# EAGLE design RH026.2 (EAGLE 7.1.0)
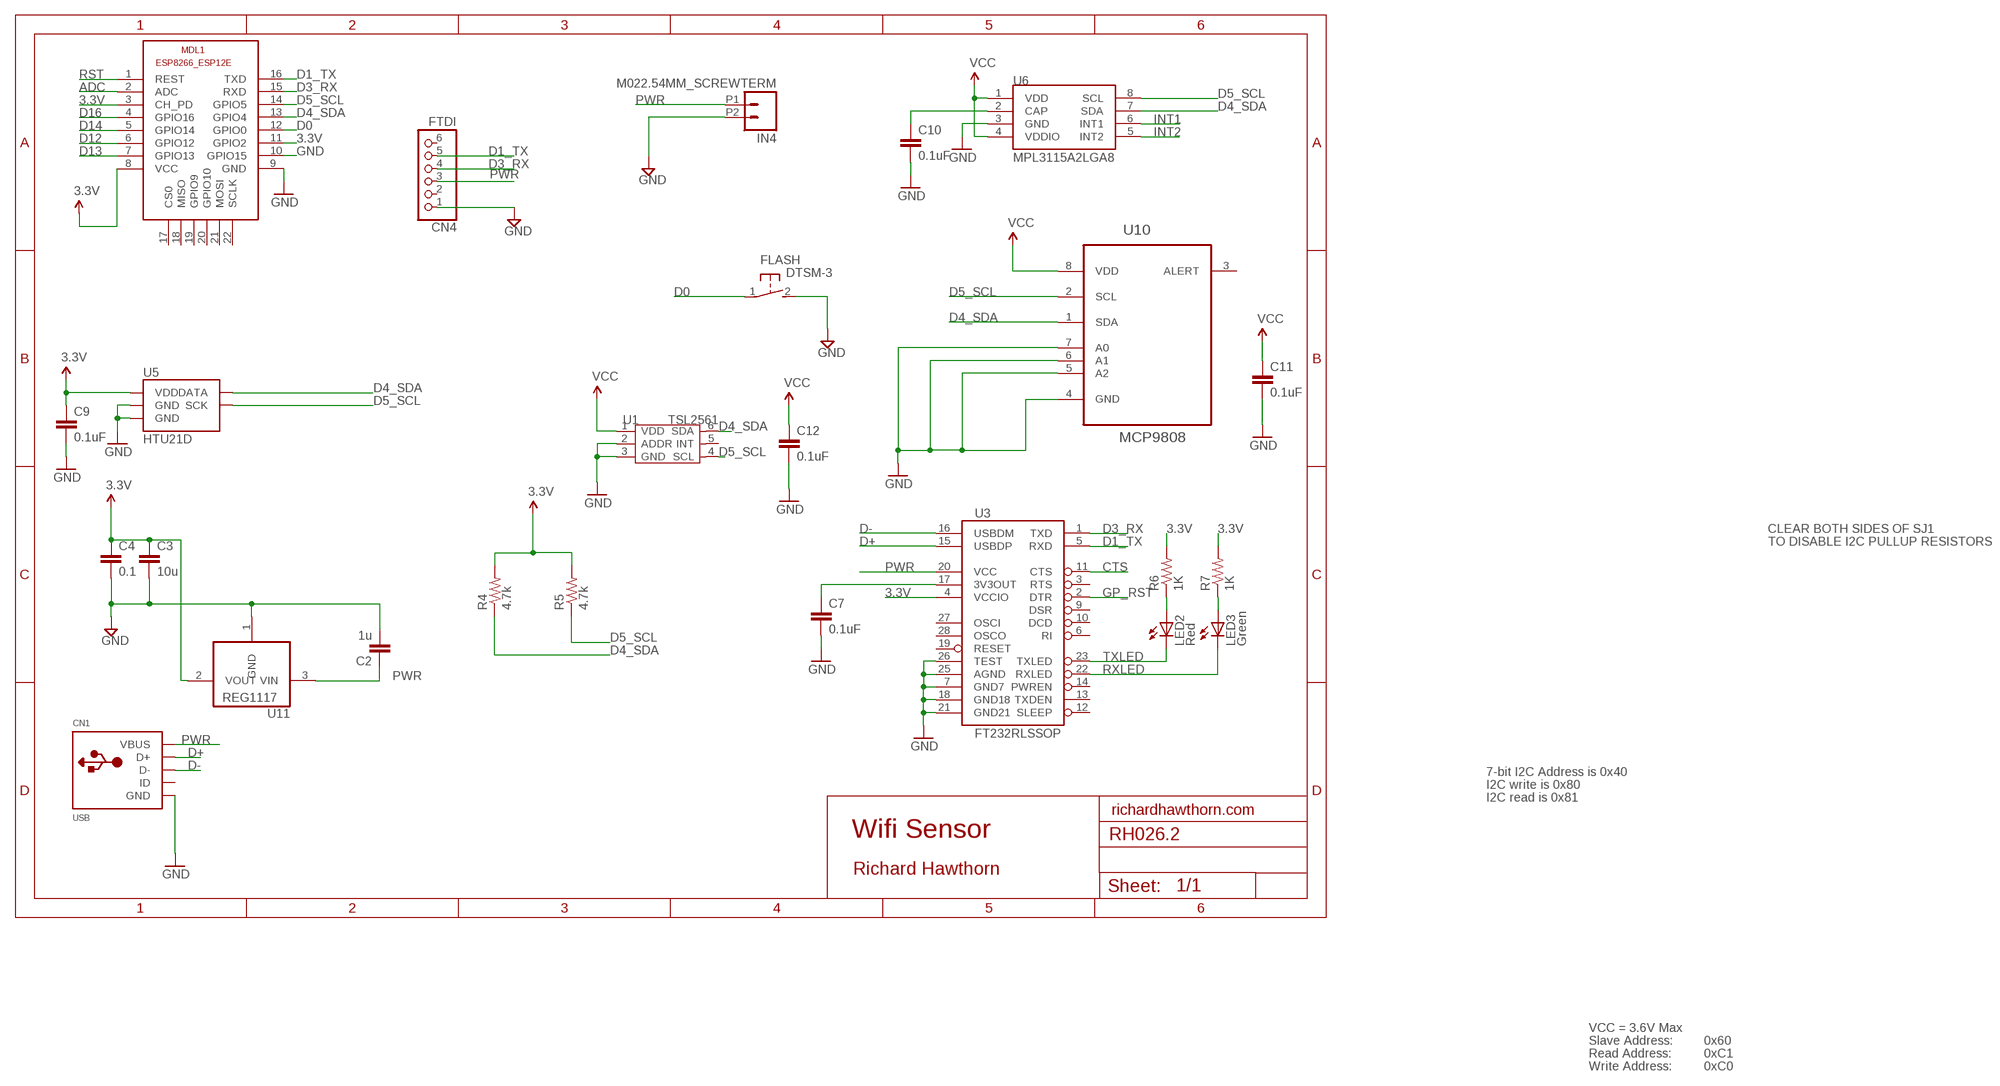
[diagram p0: schematic, sheet 1]

## Parts
C2  1u  CAP0603-CAP  [0603-CAP]
C3  10u  CAP0805-CAP  [0805-CAP]
C4  0.1  CAP0603-CAP  [0603-CAP]
C7  0.1uF  CAP0402-CAP  [0402-CAP]
C9  0.1uF  CAP0805  [0805]
C10  0.1uF  CAP0805  [0805]
C11  0.1uF  CAP0603-CAP  [0603-CAP]
C12  0.1uF  CAP0603-CAP  [0603-CAP]
CN1  USB  USBMINIB  [USB-MINIB]
CN4  FTDI  PINHD-1X6  [1X06]
FLASH  DTSM-3  [DTSM-3]
IN4  M022.54MM_SCREWTERM  [1X02_2.54_SCREWTERM]
LED2  Red  LED0603  [LED-0603]
LED3  Green  LED0603  [LED-0603]
MDL1  ESP8266-12EESP8266-ESP12E  [ESP8266-ESP12E]
R4  4.7k  RESISTOR0805-RES  [0805]
R5  4.7k  RESISTOR0805-RES  [0805]
R6  1K  RESISTOR0402-RES  [0402-RES]
R7  1K  RESISTOR0402-RES  [0402-RES]
U1  TSL2561  TSL2561T  [TMB-6]
U3  FT232RLSSOP  [SSOP28DB]
U5  HTU21D  HTU21DSMD  [HTU21D]
U6  MPL3115A2LGA8  [LGA8]
U10  MCP9808  MCP9808-E/MS  [SOP65P490X110-8N]
U11  REG1117  [SOT223]

## Nets
3.3V: C3.1 C4.1 C9.1 C11.1 C12.1 MDL1.3(CH_PD) MDL1.8(VCC) MDL1.11(GPIO2) R4.2 R5.2 R6.2 R7.2 U1.1(VDD) U3.4(VCCIO) U5.VDD U6.1(VDD) U6.4(VDDIO) U10.8(VDD) U11.2(VOUT) ; supply symbol labelled VCC
3.3VOUT: C7.1 U3.17(3V3OUT)
ADC: MDL1.2(ADC)
CTS: U3.11(CTS)
D0: FLASH.1 MDL1.12(GPIO0)
D1_TX: CN4.5 MDL1.16(TXD) U3.5(RXD)
D3_RX: CN4.4 MDL1.15(RXD) U3.1(TXD)
D4_SDA: MDL1.13(GPIO4) R4.1 U1.6(SDA) U5.DATA U6.7(SDA) U10.1(SDA)
D5_SCL: MDL1.14(GPIO5) R5.1 U1.4(SCL) U5.SCK U6.8(SCL) U10.2(SCL)
D12: MDL1.6(GPIO12)
D13: MDL1.7(GPIO13)
D14: MDL1.5(GPIO14)
D16: MDL1.4(GPIO16)
D+: CN1.D+ U3.15(USBDP)
D-: CN1.D- U3.16(USBDM)
GND [power]: C2.2 C3.2 C4.2 C7.2 C9.2 C10.2 C11.2 C12.2 CN1.GND CN4.1 FLASH.2 IN4.P2 MDL1.9(GND) MDL1.10(GPIO15) U1.2(ADDR) U1.3(GND) U3.7(GND7) U3.18(GND18) U3.21(GND21) U3.25(AGND) U3.26(TEST) U5.7(GND) U5.GND U6.3(GND) U10.4(GND) U10.5(A2) U10.6(A1) U10.7(A0) U11.1(GND)
GP_RST: U3.2(DTR)
INT1: U6.6(INT1)
INT2: U6.5(INT2)
N$2: LED2.A R6.1
N$3: LED3.A R7.1
N$9: C10.1 U6.2(CAP)
PWR [power]: C2.1 CN1.VBUS CN4.3 IN4.P1 U3.20(VCC) U11.3(VIN)
RST: MDL1.1(REST)
RXLED: LED3.C U3.22(RXLED)
TXLED: LED2.C U3.23(TXLED)
Unconnected: CN1.ID CN4.2 CN4.6 MDL1.17(CS0) MDL1.18(MISO) MDL1.19(GPIO9) MDL1.20(GPIO10) MDL1.21(MOSI) MDL1.22(SCLK) U1.5(INT) U3.3(RTS) U3.6(RI) U3.9(DSR) U3.10(DCD) U3.12(SLEEP) U3.13(TXDEN) U3.14(PWREN) U3.19(RESET) U3.27(OSCI) U3.28(OSCO) U10.3(ALERT)

## Notes on the sheet
- CLEAR BOTH SIDES OF SJ1
- TO DISABLE I2C PULLUP RESISTORS
- 7-bit I2C Address is 0x40
- I2C write is 0x80
- I2C read is 0x81
- richardhawthorn.com
- Wifi Sensor
- Richard Hawthorn
- VCC = 3.6V Max
- Slave Address: | 0x60
- Read Address: | 0xC1
- Write Address: | 0xC0

## Library data of the parts
C2-C4 = LowPowerLab:CAP: Capacitor Standard 0603 ceramic capacitor, and 0.1" leaded capacitor.
C7 C9-C12 = SparkFun:CAP: Capacitor Standard 0603 ceramic capacitor, and 0.1" leaded capacitor.
CN1 = LowPowerLab:USB: USB Connectors USBMINIB - Surface Mount Female Mini-B USB Connector 4UConnector: 06564 By microbuilder.eu Thru-hole RA Female Mini-B USB Connector 4UConnector: 18732 By ladyada.net
CN4 = pinhead:PINHD-1X6: PIN HEADER
FLASH = switch-tact:DTSM-3
IN4 = SparkFun-Connectors:M02: Standard 2-pin 0.1" header. Use with - straight break away headers ( PRT-00116) - right angle break away headers (PRT-00553) - swiss pins (PRT-00743) - machine pins (PRT-00117) - female headers (PRT-00115) Molex polarized connector foot print use with: PRT-08233 with associated crimp pins and housings. 2.54_SCREWTERM for use with PRT-10571. 3.5mm Screw Terminal footprints for PRT-08084 5mm Screw Terminal footprints for use with PRT-08432
LED2 LED3 = SparkFun:LED: LEDs Standard schematic elements and footprints for 5mm, 3mm, 1206, and 0603 sized LEDs. 5mm - Spark Fun Electronics SKU : COM-00529 (and others)
MDL1 = ESP8266-ESP12E:ESP8266-12E: ESP8266-12E with additional I/O and GPIO04/05 corrected The author cannot warrant that this library is free from error or will meet your specific requirements. Created by PuceBaboon.com. Komagane, Nagano, JAPAN
R4-R7 = SparkFun:RESISTOR: Resistor Basic schematic elements and footprints for 0603, 1206, and PTH resistors.
U1 = template:TSL2561: Light-TO-Digital Converter
U3 = SparkFun:FT232RL: USB UART FT232RL 4th Generation USB UART (USB <-> Serial) Controller. Spark Fun Electronics SKU : COM-00650
U5 = SparkFun-Sensors:HTU21D
U6 = SparkFun-Sensors:MPL3115A2: Altimeter/Pressure Sensor, I2C, 1.95V-3.6V supply, 50 to 110kPa
U10 = Richard1:MCP9808-E/MS: Digital Temperature Sensor,MSOP-8; MPN: MCP9808-E/MS; OC_FARNELL: 2080523; OC_NEWARK: 89T8871; PACKAGE: MSOP-8; SUPPLIER: MICROCHIP
U11 = burr-brown:REG1117: 800mA and 1A Low Dropout (LDO) Positive Regulator 1.8V, 2.5V, 2.85V, 3.3V, 5V, and Adj; MPN: REG1117; OC_FARNELL: 1097566; OC_NEWARK: 14P6981

## Net classes
1 power: width 0.381 mm, clearance 0.254 mm

## Board
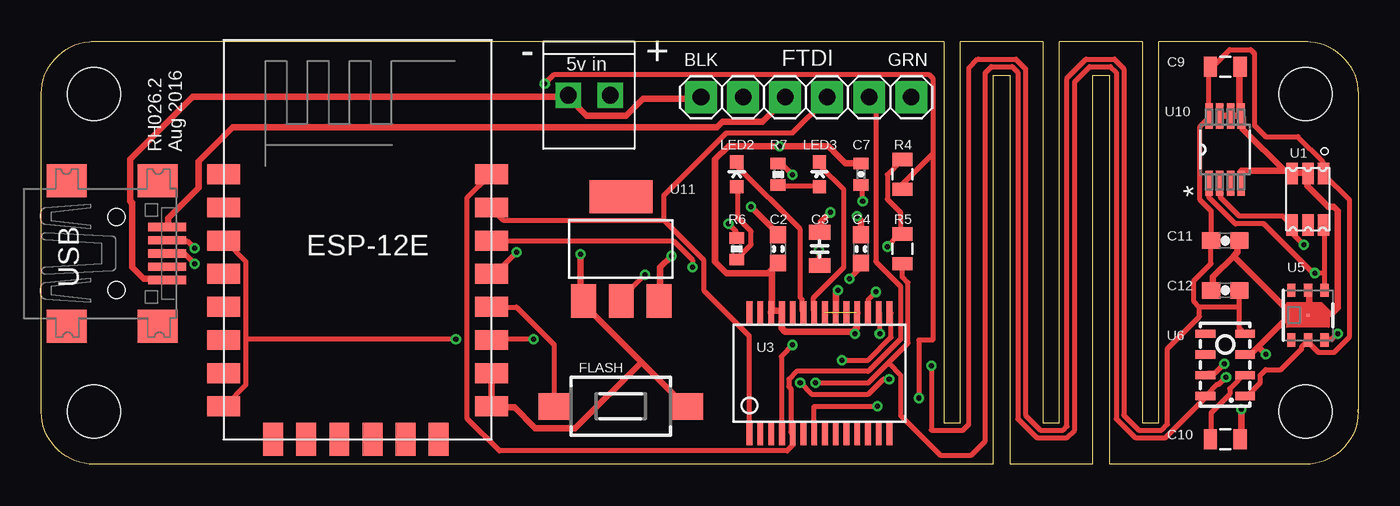
[diagram p1: board, top side]
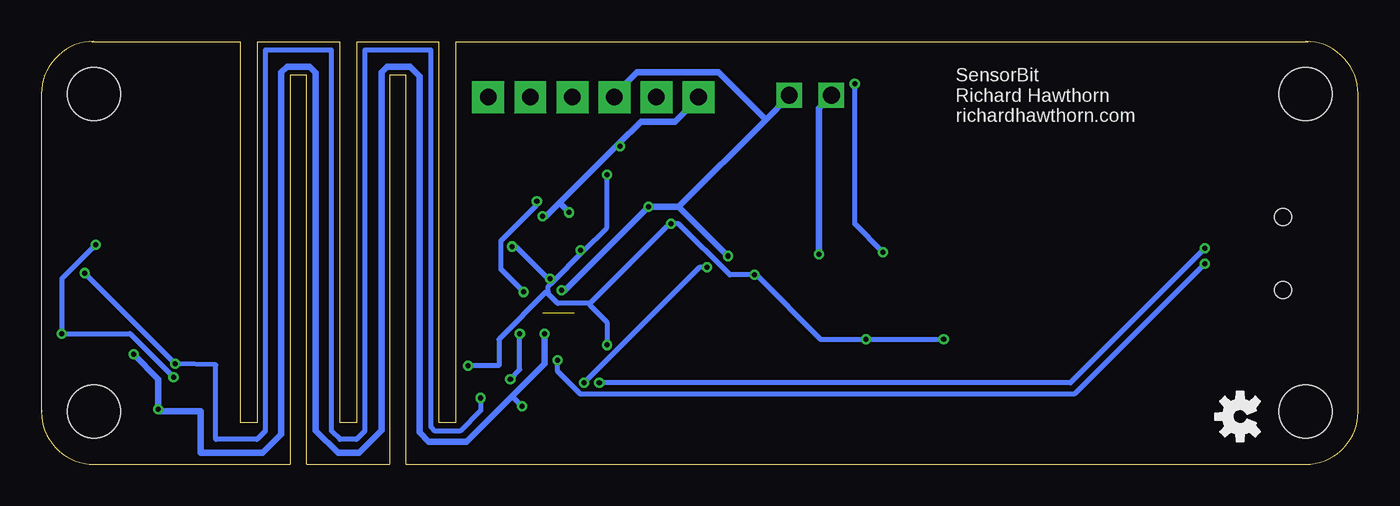
[diagram p2: board, bottom side, seen from below]

Size 79.53 x 25.53 mm. Coordinates in mm from the lower left corner, seen from the top.
Outline: 3.17,25.53 arc90 0,22.36 0,3.17 arc90 3.17,0 57.5,0 57.5,23.5 58.5,23.5 58.5,0 63.5,0 63.5,23.5 64.5,23.5 64.5,0 76.36,0 arc90 79.53,3.17 79.5,3.17 79.5,3.25 79.53,3.25 79.53,22.36 arc90 76.36,25.53
Outline: 76.5,25.5 67.5,25.5 67.5,2.5 66.5,2.5 66.5,25.5 61.5,25.5 61.5,2.5 60.5,2.5 60.5,25.5 55.5,25.5 55.5,2.5 54.5,2.5 54.5,25.5 3,25.5
Copper layers (1*16): Top 0.035mm / dielectric 1.5mm / Bottom 0.035mm
Design rules "ITEADstudio_DRC *": minimum track width 12mil, minimum drill 12mil, track to track 6mil, track to pad 6mil, pad to pad 6mil, via to via 6mil, smd to smd 0mil, copper to edge 10mil, drill to drill 10mil, minimum pad ring 10mil, minimum via ring 6mil, stop-mask expansion 2mil, vias tented up to drill 100mil, thermal gap 15mil
Holes 3.2 mm at 3.17,3.17 76.36,3.17 3.17,22.36 76.36,22.36
tRestrict: area 74,0 to 79.5,5.5; area 0,20 to 5.5,25.5; area 0,0 to 5.5,5.5; area 74,20 to 79.5,25.5
bRestrict: area 0,0 to 5.5,5.5; area 0,20 to 5.5,25.5; area 74,20 to 79.5,25.5

### Footprints (pad centres in the part's own frame; a part is rotated, then mirrored left to right if it is on the bottom)
0603-CAP = smd 1.016 x 0.965: 1 -0.85,0; 2 0.85,0
0805-CAP = smd 0.902 x 1.3: 1 -1,0; 2 1,0
0402-CAP = smd 0.7 x 0.9: 1 -0.65,0; 2 0.65,0
0805 = smd 0.8 x 1.2: 1 -0.9,0; 2 0.9,0
0603-CAP' = smd 1.1 x 1: 1 -0.85,0; 2 0.85,0
USB-MINIB = smd 0.5 x 2.308: D+ 0,4.064; D- -0.8,4.064; GND 1.6,4.064; ID 0.8,4.064; VBUS -1.6,4.064 | smd 2 x 2.4: GND1 -4.4,-2; GND2 -4.4,3.5; GND3 4.4,3.5; GND4 4.4,-2 | hole 1: -2.2,1; 2.2,1
1X06 = drill 1 pad 1.93 square: 1 -6.35,0; 2 -3.81,0; 3 -1.27,0; 4 1.27,0; 5 3.81,0; 6 6.35,0
DTSM-3 = smd 2 x 1.6: 1 -3.97,0; 2 3.97,0
1X02_2.54_SCREWTERM = drill 1.016 square: P1 2.54,0; P2 0,0
LED-0603 = smd 0.8 x 0.8: A 0,-0.75; C 0,0.75
ESP8266-ESP12E = smd 2 x 1.2: 1 0,16; 2 0,14; 3 0,12; 4 0,10; 5 0,8; 6 0,6; 7 0,4; 8 0,2; 9 16.2,2; 10 16.2,4; 11 16.2,6; 12 16.2,8; 13 16.2,10; 14 16.2,12; 15 16.2,14; 16 16.2,16 | smd 1.2 x 2: 17 11,0; 18 3,0; 19 5,0; 20 13,0; 21 7,0; 22 9,0
0402-RES = smd 0.7 x 0.9: 1 -0.65,0; 2 0.65,0
TMB-6 = smd 1.3 x 0.7: 1 -1.55,0.95; 2 -1.55,0; 3 -1.55,-0.95; 4 1.55,-0.95; 5 1.55,0; 6 1.55,0.95
SSOP28DB = smd 0.348 x 1.397: 1 -4.225,-3.656; 2 -3.575,-3.656; 3 -2.925,-3.656; 4 -2.275,-3.656; 5 -1.625,-3.656; 6 -0.975,-3.656; 7 -0.325,-3.656; 8 0.325,-3.656; 9 0.975,-3.656; 10 1.625,-3.656; 11 2.275,-3.656; 12 2.925,-3.656; 13 3.575,-3.656; 14 4.225,-3.656; 15 4.225,3.656; 16 3.575,3.656; 17 2.925,3.656; 18 2.275,3.656; 19 1.625,3.656; 20 0.975,3.656; 21 0.325,3.656; 22 -0.325,3.656; 23 -0.975,3.656; 24 -1.625,3.656; 25 -2.275,3.656; 26 -2.925,3.656; 27 -3.575,3.656; 28 -4.225,3.656
HTU21D = smd 0.2 x 0.2: 7 0,0 | smd 0.8 x 0.5: DATA 1.5,-1; GND 1.5,0; NC@1 -1.5,1; NC@6 1.5,1; SCK -1.5,-1; VDD -1.5,0
LGA8 = smd 1.2 x 0.5: 1 -1.2,1.875; 2 -1.2,0.625; 3 -1.2,-0.625; 4 -1.2,-1.875; 5 1.2,-1.875; 6 1.2,-0.625; 7 1.2,0.625; 8 1.2,1.875
SOP65P490X110-8N = smd 1.524 x 0.457: 1 -2.032,0.965; 2 -2.032,0.33; 3 -2.032,-0.33; 4 -2.032,-0.965; 5 2.032,-0.965; 6 2.032,-0.33; 7 2.032,0.33; 8 2.032,0.965
SOT223 = smd 1.499 x 2.007: 1 -2.261,-3.15; 2 0.025,-3.15; 3 2.311,-3.15 | smd 3.81 x 2.007: 4 0,3.15

### Placement (x,y rotation side)
C2  44.5,13 270 top
C3  47,13 90 top
C4  49.5,13 90 top
C7  49.5,17.5 90 top
C9  71.5,24 0 top
C10  71.5,1.5 0 top
C11  0.1uF  [0603-CAP']  71.5,13.5 0 top
C12  0.1uF  [0603-CAP']  71.5,10.5 180 top
CN1  3.53,12.73 270 top
CN4  46.19,22.17 0 top
FLASH  35,3.5 0 top
IN4  31.82,22.29 0 top
LED2  42,17.5 0 top
LED3  47,17.5 0 top
MDL1  11,1.5 0 top
R4  52,17.5 90 top
R5  52,13 90 top
R6  42,13 90 top
R7  44.5,17.5 90 top
U1  76.5,16 270 top
U3  47,5.5 0 top
U5  76.5,9 90 top
U6  71.5,6 180 top
U10  71.5,19 90 top
U11  35,13 0 top
U$3  [OSHW-LOGO-S]  7.13,2.88 90 bottom

### Tracks (layer width: path | path; a pad name or v marks a point on that pad's centre or on a via)
3.3V  (via drill 0.3)
  Top 0.305: 72.35,9.49 72.35,8.23 U6.4 | 72.35,9.49 72.35,10.4 C12.1 | 69.95,9.49 69.61,9.83 69.61,11.09 70.64,12.12 70.64,13.49 C11.1 70.64,13.6 70.64,15.32 69.95,16 69.95,20.34 70.52,20.92 U10.8 70.52,21.14 70.52,23.89 C9.1 70.75,24 71.78,25.03 73.04,25.03 73.27,24.8 73.27,20.46 73.95,19.77 75.89,19.77 77.38,18.29 77.38,17.6 U1.1 77.5,17.49 78.98,16 78.98,7.66 78.07,6.74 77.15,6.74 76.58,7.32 U5.VDD 76.47,7.43 76.12,7.09 76.12,6.97 74.87,5.71 73.95,5.71 73.61,5.37 73.61,4.92 72.81,4.12 U6.1 | 72.35,9.49 69.95,9.49 | 12.34,7.54 12.34,12.23 11.09,13.49 MDL1.3 | 12.34,7.54 12.34,4.8 11.09,3.54 MDL1.8 | R4.2 51.89,18.29 51.09,17.49 51.09,16 51.89,15.2 51.89,13.95 R5.2 51.78,13.83 v51.09,13.14 | v41.49,14.52 41.95,14.06 41.95,13.72 R6.2 | v36.46,11.43 34.98,9.94 U11.2 | v45.38,17.49 44.81,18.06 44.58,18.06 R7.2 | v48.81,11.2 49.49,11.89 49.49,12.12 C4.1 | v46.98,12.92 46.98,12 C3.1 | v45.38,7.2 44.69,6.51 44.69,1.94 U3.4 | v29.72,7.54 27.2,7.54 MDL1.11 | v25.03,7.54 12.34,7.54 | 69.95,9.49 69.95,8.91 68.01,6.97 68.01,2.4 67.67,2.06 66.29,2.06 65.38,2.97 65.38,23.89 64.81,24.46 63.09,24.46 61.95,23.32 61.95,2.29 61.72,2.06 60.35,2.06 59.44,2.97 59.44,23.89 58.86,24.46 56.58,24.46 56.58,24.48 56.01,23.91 56.01,2.4 55.66,2.06 53.75,2.06 v53.75,5.96
  Bottom 0.305: v45.38,17.49 45.38,14.29 46.81,12.86 | 48.63,11.03 48.92,10.74 48.92,10.4 | 48.63,11.03 46.81,12.86 | 48.92,10.4 48.92,10.29 48.35,9.72 46.41,9.72 | 46.41,9.72 41.6,14.52 v41.49,14.52 41.03,14.52 37.95,11.43 v36.46,11.43 36.35,11.43 32.46,7.54 v29.72,7.54 v25.03,7.54 | 48.63,11.03 v48.81,11.2 48.92,11.2 50.86,13.14 v51.09,13.14 | v46.98,12.92 46.86,12.92 46.81,12.86 | v45.38,7.2 45.38,8.57 46.41,9.6 46.41,9.72 | v53.75,5.96 51.89,5.96 51.89,7.54 49.03,10.4 48.92,10.4
3.3VOUT  (via drill 0.3)
  Top 0.305: v49.61,15.89 49.61,16.8 C7.1 | v50.41,10.4 49.95,9.94 49.95,9.26 U3.17
  Bottom 0.305: v49.61,15.89 49.61,15.66 51.78,13.49 51.78,11.77 v50.41,10.4
D0
  Top 0.305: FLASH.1 30.98,3.54 30.98,7.2 28.69,9.49 27.2,9.49 MDL1.12
D1_TX
  Top 0.305: CN4.5 50.06,22.06 50.41,21.72 50.41,12.23 51.89,10.74 51.89,7.54 49.95,5.6 45.61,5.6 45.15,5.14 45.15,4.69 45.26,4.57 45.26,1.94 U3.5 45.38,1.71 45.38,1.14 45.03,0.8 27.66,0.8 25.72,2.74 25.72,16.12 27.09,17.49 MDL1.16
D3_RX
  Top 0.305: 37.6,14.74 40.01,12.34 40.01,10.52 42.75,7.77 42.75,1.94 U3.1 | 37.6,14.74 27.89,14.74 27.2,15.43 MDL1.15 | 37.6,14.74 37.6,16.23 41.38,20 45.38,20 47.43,22.06 CN4.4
D4_SDA  (via drill 0.3)
  Top 0.305: 53.84,18.75 52.01,16.92 52.01,16.69 R4.1 | 53.84,18.75 53.84,23.32 53.61,23.55 30.98,23.55 v30.4,22.97 | v28.69,12.8 27.43,11.54 27.2,11.54 MDL1.13 | 77.5,11.54 77.5,14.4 U1.6 | 77.5,11.54 77.5,10.52 U5.DATA | v71.44,6.06 70.87,5.49 70.41,5.49 U6.7 | 77.5,11.54 v76.92,11.54 76.81,11.54 73.84,14.52 72.12,14.52 70.52,16.12 70.52,16.92 U10.1 | 53.84,18.75 53.84,7.5 53,7.5 v53,4
  Bottom 0.305: v30.4,22.97 30.4,14.52 v28.69,12.8 | v76.92,11.54 v71.44,6.06 69,6 69,1.5 66.5,1.5 66,2 66,25 62,25 62,2 61.5,1.5 60.5,1.5 60,2 60,25 56,25 56,2.25 55.75,2 54.25,2 53,3.25 v53,4
D5_SCL  (via drill 0.3)
  Top 0.305: v78.3,7.89 77.95,7.54 77.61,7.54 U5.SCK | v76.24,13.26 75.55,13.95 75.55,14.4 U1.4 75.44,14.52 74.98,14.97 72.35,14.97 71.21,16.12 71.21,16.92 U10.2 | v71.55,5.26 71.09,4.8 70.98,4.8 70.41,4.23 U6.8 70.29,4 67.89,1.6 66.06,1.6 64.92,2.74 64.92,23.66 64.58,24 63.32,24 62.41,23.09 62.41,2.06 61.95,1.6 60.12,1.6 58.98,2.74 58.98,23.66 58.64,24 57.38,24 57.01,23.63 57.01,1.4 56.16,0.56 54.29,0.56 51.89,2.96 51.89,5.37 51.15,6.12 | 51.15,6.12 49.95,4.92 v46.75,4.92 | 51.15,6.12 52.35,7.32 52.35,10.97 52.01,11.32 52.01,12 R5.1 | v39.32,11.89 39.32,12.34 38.18,13.49 27.2,13.49 MDL1.14
  Bottom 0.305: v76.24,13.26 78.3,11.2 v78.3,7.89 74.18,7.89 v71.55,5.26 | v46.75,4.92 39.78,11.89 v39.32,11.89
D+  (via drill 0.3)
  Top 0.305: v48.35,6.29 49.95,6.29 51.32,7.66 51.32,9.14 U3.15 | v9.26,12.12 8.69,12.69 7.66,12.69 CN1.D+
  Bottom 0.305: v48.35,6.29 48.35,5.6 46.98,4.23 17.14,4.23 v9.26,12.12
D-  (via drill 0.3)
  Top 0.305: v50.63,7.89 50.63,9.14 U3.16 | v51.21,5.14 50.86,5.14 49.95,4.23 46.52,4.23 v45.83,4.92 | v9.26,13.03 8.8,13.49 7.66,13.49 CN1.D-
  Bottom 0.305: v50.63,7.89 50.63,5.71 v51.21,5.14 | v45.83,4.92 17.37,4.92 v9.26,13.03
GND  (via drill 0.3)  (1 unrouted)
  Top 0.305: U3.7 46.67,3.5 v50.5,3.5
  Top 0.381: U10.7 71.21,21.03 71.78,21.03 U10.6 72.01,21.03 72.24,21.03 U10.5 | C9.2 72.35,23.89 72.35,21.14 U10.5 | U10.5 72.58,20.92 72.58,20.23 75.09,17.72 75.44,17.72 U1.3 75.55,17.6 76.47,17.6 U1.2 76.47,17.37 76.47,16.8 77.72,15.54 78.07,15.54 78.3,15.32 78.3,9.44 77.95,9.1 76.58,9.1 | 72.01,12.57 72.24,12.8 72.24,13.49 C11.2 | 72.01,12.57 70.75,11.32 70.75,10.52 C12.2 | 76.58,9.1 76.58,9.03 U5.7 76.35,8.91 75.32,8.91 | 76.58,9.1 76.58,10.4 U5.GND | 73.5,7.09 73.04,6.63 72.81,6.63 U6.3 | 73.5,7.09 75.32,8.91 | v72.47,3.31 72.47,1.6 C10.2 | 73.5,7.09 v73.95,6.63 | 72.01,12.57 75.21,9.37 75.21,9.03 75.32,8.91 | 49.03,8 49.26,8.23 49.26,9.14 U3.18 | 49.03,8 44.92,8 44.69,8.23 44.69,9.03 U3.25 44.69,9.26 44.12,9.26 U3.26 44.12,9.37 44.12,11.54 44.01,11.66 | 44.01,11.66 44.46,12.12 C2.2 | 44.01,11.66 43.89,11.54 41.38,11.54 40.69,12.23 40.69,18.4 41.49,19.2 v44.58,19.2 47.55,19.2 48.58,18.17 49.49,18.17 C7.2 | v49.26,14.97 49.49,14.74 49.49,13.95 C4.2 | v47.66,15.2 47.09,14.63 47.09,14.06 C3.2 | MDL1.10 27.2,5.49 27.2,3.54 MDL1.9 27.32,3.43 28.57,3.43 29.83,2.17 32.23,2.17 36.23,6.17 | 36.23,6.17 32.8,9.6 32.8,9.83 U11.1 32.58,9.94 v32.58,12.69 | 36.23,6.17 38.86,3.54 FLASH.2 | CN1.GND 7.54,11.2 6.17,11.2 5.49,11.89 5.49,15.77 5.37,15.89 5.37,18.4 9.14,22.17 31.77,22.17 IN4.P2 31.89,22.06 32.92,21.03 35.32,21.03 36.35,22.06 39.78,22.06 CN4.1 | v49.15,7.89 49.03,8
  Top 0.406: 75.09,17.72 72.47,17.72 U10.4
  Bottom 0.305: v50.5,3.5 51.1,4.1
  Bottom 0.381: v73.95,6.63 72.47,5.14 v72.47,3.31 72.35,3.2 69.92,3.2 69.92,0.69 66.16,0.69 65.04,1.81 65.04,23.66 64.69,24 63.32,24 62.95,23.63 62.95,2.04 61.61,0.69 60.35,0.69 58.98,2.06 58.98,23.66 58.64,24 57.26,24 56.69,23.43 56.69,1.92 56.14,1.37 53.84,1.37 51.1,4.1 49.15,6.06 v49.15,7.89 | v49.26,14.97 49.03,14.97 48.23,15.77 | 44.69,19.32 43.32,20.69 41.26,20.69 39.89,22.06 CN4.1 | 44.69,19.32 48.23,15.77 | 48.23,15.77 v47.66,15.2 | v44.58,19.2 44.69,19.32 | v32.58,12.69 32.58,21.49 31.89,22.17 IN4.P2
N$2
  Top 0.305: LED2.A 42.06,16.69 42.06,14.86 42.86,14.06 42.86,13.26 42.06,12.46 R6.1
N$3
  Top 0.305: LED3.A 46.98,16.8 44.58,16.8 R7.1
N$9
  Top 0.305: C10.1 70.64,1.6 70.64,3.09 71.78,4.23 71.78,4.57 72.69,5.49 U6.2
PWR  (via drill 0.3)
  Top 0.381: v42.86,15.54 44.46,13.95 C2.1 | v48.12,10.52 48.01,10.4 48.01,9.26 U3.20 | v38.06,12.57 37.38,11.89 37.38,9.94 U11.3 | CN1.VBUS 7.66,14.4 7.66,14.86 9.49,16.69 9.49,18.29 11.54,20.34 40.8,20.34 41.15,20.69 43.55,20.69 44.92,22.06 CN4.3
  Bottom 0.381: 41.03,15.54 v42.86,15.54 47.89,10.52 v48.12,10.52 | 35.78,20.8 34.4,22.17 IN4.P1 | 35.78,20.8 41.03,15.54 | 41.03,15.54 v38.06,12.57 | 35.78,20.8 38.63,23.66 43.55,23.66 45.03,22.17 CN4.3
RXLED
  Top 0.305: LED3.C 47.09,18.17 47.09,17.95 48.46,16.57 48.46,11.89 46.63,10.06 46.63,9.26 U3.22
TXLED
  Top 0.305: LED2.C 42.06,18.17 42.06,17.95 45.83,14.17 45.83,10.06 45.95,9.94 45.95,9.26 U3.23

### Text on the board
tNames: - | 5v in | + | BLK | FTDI | GRN | RH026.2 / Aug 2016
bNames: SensorBit / Richard Hawthorn / richardhawthorn.com
tDocu: REG